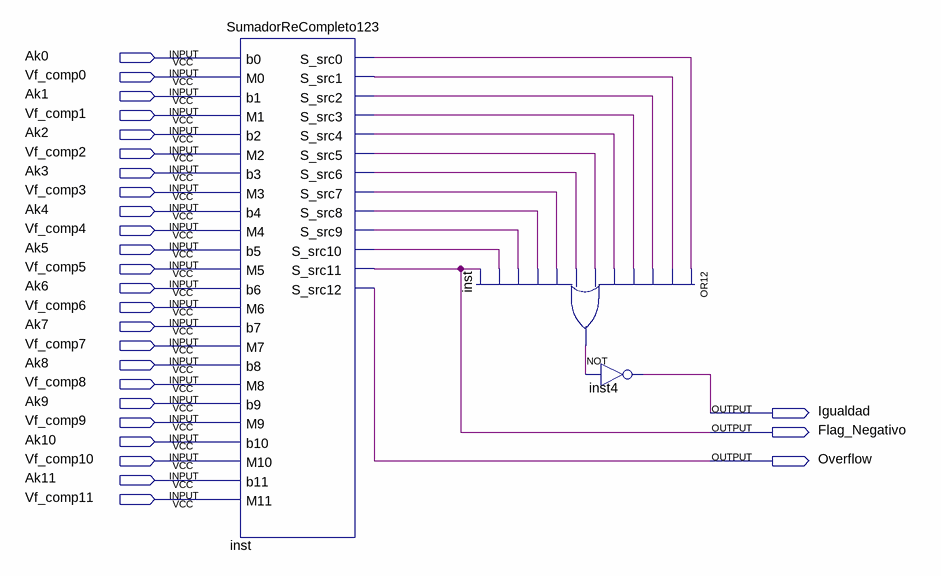
[diagram p0: schematic sheet]
// Quartus schematic Comparador12bits.bdf as structural Verilog: 3 symbols, 27 pins
module Comparador12bits (
  input  Ak0,
  input  Vf_comp0,
  input  Ak1,
  input  Vf_comp1,
  input  Ak2,
  input  Vf_comp2,
  input  Ak3,
  input  Vf_comp3,
  input  Ak4,
  input  Vf_comp4,
  input  Ak5,
  input  Vf_comp5,
  input  Ak6,
  input  Vf_comp6,
  input  Ak7,
  input  Vf_comp7,
  input  Ak8,
  input  Vf_comp8,
  input  Ak9,
  input  Vf_comp9,
  input  Ak10,
  input  Vf_comp10,
  input  Ak11,
  input  Vf_comp11,
  output Igualdad,
  output Flag_Negativo,
  output Overflow
);

  wire inst_out, inst_s_src0, inst_s_src1, inst_s_src2, inst_s_src3, inst_s_src4, inst_s_src5, inst_s_src6,
       inst_s_src7, inst_s_src8, inst_s_src9, inst_s_src10;

  SumadorReCompleto123 inst (
    .b0(Ak0), .M0(Vf_comp0), .b1(Ak1), .M1(Vf_comp1), .b2(Ak2), .M2(Vf_comp2), .b3(Ak3), .M3(Vf_comp3),
    .b4(Ak4), .M4(Vf_comp4), .b5(Ak5), .M5(Vf_comp5), .b6(Ak6), .M6(Vf_comp6), .b7(Ak7), .M7(Vf_comp7),
    .b8(Ak8), .M8(Vf_comp8), .b9(Ak9), .M9(Vf_comp9), .b10(Ak10), .M10(Vf_comp10), .b11(Ak11),
    .M11(Vf_comp11), .S_src0(inst_s_src0), .S_src1(inst_s_src1), .S_src2(inst_s_src2), .S_src3(inst_s_src3),
    .S_src4(inst_s_src4), .S_src5(inst_s_src5), .S_src6(inst_s_src6), .S_src7(inst_s_src7),
    .S_src8(inst_s_src8), .S_src9(inst_s_src9), .S_src10(inst_s_src10), .S_src11(Flag_Negativo),
    .S_src12(Overflow));
  or inst_dup2 (inst_out, inst_s_src0, inst_s_src1, inst_s_src2, inst_s_src3, inst_s_src4, inst_s_src5, inst_s_src6, inst_s_src7, inst_s_src8, inst_s_src9, inst_s_src10, Flag_Negativo);
  not inst4 (Igualdad, inst_out);
endmodule
